# Altium schematic sheet DC-DC-converter_v2.SchDoc: Boost converter
size A4; Author: Alexander Thoresen; CompanyName: VORTEX NTNU; Revision: A; SheetNumber: 1; SheetTotal: 1
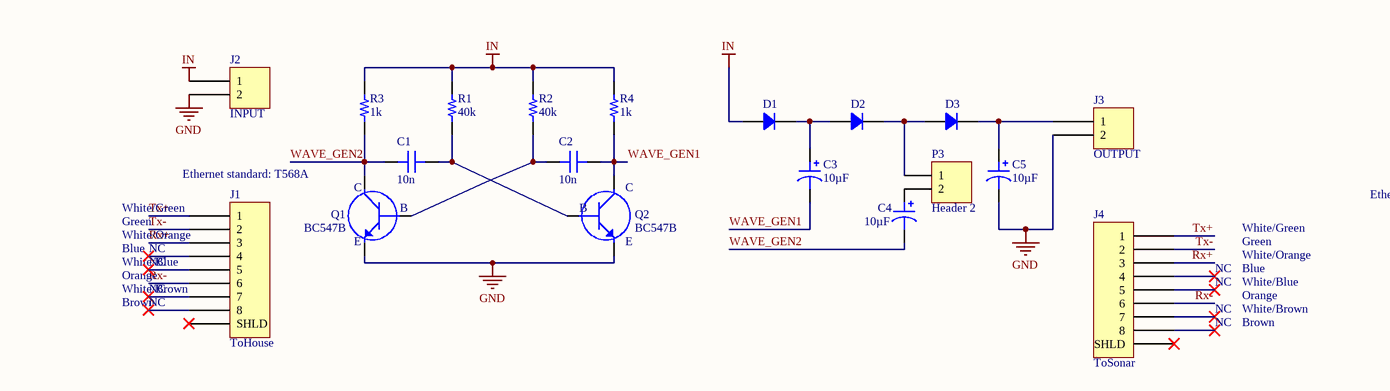
[diagram p0: DC-DC-converter_v2.SchDoc]

## Parts
C1  10n  [CAP 0805_2012]
C2  10n  [CAP 0805_2012]
C3  10µF  [CAP ALSMD 6.6MM H6.1MM]
C4  10µF  [CAP ALSMD 6.6MM H6.1MM]
C5  10µF  [CAP ALSMD 6.6MM H6.1MM]
D1  MBR0580-TP  [SOD-123]  (value not drawn)
D2  MBR0580-TP  [SOD-123]  (value not drawn)
D3  MBR0580-TP  [SOD-123]  (value not drawn)
J1  Custom Description 2: ToHouse  [ASSMANN A-2004-2-4-LPS-N-R]  (hidden comment: A-2004-2-4-LPS-N-R)
J2  Custom Description: INPUT  [MOLEX KK 0022272021]  (hidden comment: 0022272021)
J3  Custom Description: OUTPUT  [MOLEX KK 0022272021]  (hidden comment: 0022272021)
J4  Custom Description 2: ToSonar  [ASSMANN A-2004-2-4-LPS-N-R]  (hidden comment: A-2004-2-4-LPS-N-R)
P3  Header 2  [HDR1X2]
Q1  BC547B  [BC547B]
Q2  BC547B  [BC547B]
R1  40k  [RES 0805_2012]
R2  40k  [RES 0805_2012]
R3  1k  [RES 0805_2012]
R4  1k  [RES 0805_2012]

## Nets
GND: C5.2 J2.2 J3.2 Q1.3 Q2.3
IN: D1.1 J2.1 R1.1 R2.2 R3.1 R4.1
Rx+: J1.3 J4.3
Rx-: J1.6 J4.6
Tx+: J1.1 J4.1
Tx-: J1.2 J4.2
WAVE_GEN1: C2.2 C3.2 Q2.1 R4.2
WAVE_GEN2: C1.1 C4.2 Q1.1 R3.2
NetC1_2: C1.2 Q2.2 R1.2
NetC2_1: C2.1 Q1.2 R2.1
NetC3_1: C3.1 D1.2 D2.1
NetC4_1: C4.1 P3.2
NetC5_1: C5.1 D3.2 J3.1
NetD2_2: D2.2 D3.1 P3.1

Not connected (* = marked no-connect by the designer): J1 4* 5* 7* 8* S(SHLD)*; J4 4* 5* 7* 8* S(SHLD)*

## Notes on the sheet
- Ethernet standard: T568A
- White/Green
- Green
- White/Orange
- Blue
- White/Blue
- NC
- Orange
- White/Brown
- Brown
- Title
- Size
- Author
- Rev
- A4
- Sheet no.
- of
- (in symbol BC547B) C; B; E

## Library data of the parts
C1 C2 = CBR08C330JAGAC: CAP CER 33PF 250V C0G/NP0 0805; Part Number: CBR08C330JAGAC; Value: 10n
C3-C5 = EDK106M063A9GAA: CAP ALUM 10UF 20% 63V SMD; Manufacturer: KEMET; Lifetime @ Temp.: 2000 Hrs @ 85°C; Polarization: Polar; Ripple Current @ High Frequency: 25mA @ 10kHz; Ripple Current @ Low Frequency: 20mA @ 120Hz; Surface Mount Land Size: 0.260" L x 0.260" W (6.60mm x 6.60mm); Part Number: EDK106M063A9GAA; Applications: General Purpose; Capacitance: 10µF; ComponentLink1Description: Datasheet; ComponentLink1URL: https://api.kemet.com/component-edge/download/datasheet/EDK106M063A9GAA.pdf; ComponentLink2Description: DigiKey Link; ComponentLink2URL: http://digikey.com/product-detail/en/kemet/EDK106M063A9GAA/399-6049-1-ND/2712581; Device Package: Radial, Can - SMD; Height - Seated (Max): 0.217" (5.50mm); LastUpdated: 19/01/2020 00:13:02; Lifecycle Status: Active; Minimum Order: 1; Mounting Type: Surface Mount; Operating Temperature: -40°C ~ 85°C; Package / Case: Radial, Can - SMD; Packaging: TapeAndReel; PartId: 8976; Part Status: Active; Price: 0.09; Series: EDK; Size / Dimension: 0.248" Dia (6.30mm); Supplier 1: DigiKey; Supplier Part Number 1: 399-6049-1-ND; Tolerance: ±20%; Value: 10µF; Voltage - Rated: 63V
D1-D3 = MBR0580-TP: DIODE SCHOTTKY 80V 500MA SOD123; Manufacturer: Micro Commercial Co; Capacitance @ Vr, F: 30pF @ 4V, 1MHz; Current - Reverse Leakage @ Vr: 200µA @ 80V; Speed: Fast Recovery =< 500ns, > 200mA (Io); Voltage - Forward (Vf) (Max) @ If: 800mV @ 500mA; Part Number: MBR0580-TP; ComponentLink1Description: Datasheet; ComponentLink1URL: https://www.mccsemi.com/pdf/Products/MBR0520~MBR0580(SOD123).pdf; ComponentLink2Description: DigiKey Link; ComponentLink2URL: http://digikey.com/product-detail/en/micro-commercial-co/MBR0580-TP/MBR0580-TPMSCT-ND/2423306; Current - Average Rectified (Io): 500mA; Device Package: SOD-123; Diode Type: Schottky; LastUpdated: 19/01/2020 00:13:21; Lifecycle Status: Active; Minimum Order: 1; Mounting Type: Surface Mount; Operating Temperature - Junction: -55°C ~ 150°C; Package / Case: SOD-123; Packaging: TapeAndReel; PartId: 2228; Part Status: Active; Price: 0.04; Series: -; Supplier 1: DigiKey; Supplier Part Number 1: MBR0580-TPMSCT-ND; Supplier Device Package: SOD-123; Voltage - DC Reverse (Vr) (Max): 80V
J1 = A-2004-2-4-LPS-N-R: CONN MOD JACK 8P8C R/A SHIELDED; Manufacturer: Assmann WSW Components; LED Color: Does Not Contain LED; Number of Ports: 1; Number of Positions/Contacts: 8p8c (RJ45, Ethernet); Tab Direction: Down; Custom Description1: ToSonar; ComponentLink1Description: Datasheet; ComponentLink1URL: http://www.assmann-wsw.com/fileadmin/datasheets/ASS_7323_CO.pdf; ComponentLink2Description: DigiKey Link; ComponentLink2URL: http://digikey.com/product-detail/en/assmann-wsw-components/A-2004-2-4-LPS-N-R/AE10387-ND/2183638; Connector Type: Jack; Contact Finish: Gold; Contact Material: Phosphor Bronze; Features: Board Lock; LastUpdated: 15/01/2020 03:54:20; Lifecycle Status: Active; Part Number: A-2004-2-4-LPS-N-R; Minimum Order: 1; Mounting Type: Through Hole; Number of Rows: 1; Orientation: 90° Angle (Right); Packaging: Tray; Part Status: Active; Price: 1.05; Series: -; Shielding: Shielded; Supplier 1: DigiKey; Supplier Part Number 1: AE10387-ND; Termination: Solder
J2 J3 = 0022272021: CONN HEADER VERT 2POS 2.54MM; Manufacturer: Molex; Contact Length - Mating: 0.295" (7.49mm); Contact Length - Post: 0.140" (3.56mm); Material Flammability Rating: UL94 V-0; Number of Positions: 2; Number of Positions Loaded: All; Overall Contact Length: 0.560" (14.22mm); Pitch - Mating: 0.100" (2.54mm); Shrouding: Shrouded - 1 Wall; Style: Board to Cable/Wire; ComponentLink1Description: Datasheet; ComponentLink1URL: https://www.molex.com/pdm_docs/sd/022272021_sd.pdf; ComponentLink2Description: DigiKey Link; ComponentLink2URL: http://digikey.com/product-detail/en/molex/0022272021/WM4111-ND/1130577; Connector Type: Header; Contact Finish - Mating: Tin; Contact Finish - Post: Tin; Contact Finish Thickness - Mating: 100.0µin (2.54µm); Contact Material: Brass; Contact Shape: Square; Contact Type: Male Pin; Fastening Type: Friction Lock; Insulation Color: Natural; Insulation Height: 0.461" (11.70mm); Insulation Material: Polyamide (PA), Nylon; LastUpdated: 12/01/2020 23:51:43; Lifecycle Status: Active; Part Number: 0022272021; Minimum Order: 1; Mounting Type: Through Hole; Number of Rows: 1; Packaging: Bulk; PartId: 76; Part Status: Active; Price: 0.27; Series: KK 6410; Supplier 1: DigiKey; Supplier Part Number 1: WM4111-ND; Termination: Solder
J4 = A-2004-2-4-LPS-N-R: CONN MOD JACK 8P8C R/A SHIELDED; Manufacturer: Assmann WSW Components; LED Color: Does Not Contain LED; Number of Ports: 1; Number of Positions/Contacts: 8p8c (RJ45, Ethernet); Tab Direction: Down; ComponentLink1Description: Datasheet; ComponentLink1URL: http://www.assmann-wsw.com/fileadmin/datasheets/ASS_7323_CO.pdf; ComponentLink2Description: DigiKey Link; ComponentLink2URL: http://digikey.com/product-detail/en/assmann-wsw-components/A-2004-2-4-LPS-N-R/AE10387-ND/2183638; Connector Type: Jack; Contact Finish: Gold; Contact Material: Phosphor Bronze; Features: Board Lock; LastUpdated: 15/01/2020 03:54:20; Lifecycle Status: Active; Part Number: A-2004-2-4-LPS-N-R; Minimum Order: 1; Mounting Type: Through Hole; Number of Rows: 1; Orientation: 90° Angle (Right); Packaging: Tray; Part Status: Active; Price: 1.05; Series: -; Shielding: Shielded; Supplier 1: DigiKey; Supplier Part Number 1: AE10387-ND; Termination: Solder; Custom Description1: ToSonar
P3 = Header 2: Header, 2-Pin; LatestRevisionDate: 17-Jul-2002; LatestRevisionNote: Re-released for DXP Platform.; Publisher: Altium Limited
R1-R4 = TLRZ2ATTD: RES 0 OHM JUMPER 0805; Part Number: TLRZ2ATTD
  R1 R2: Value: 40k
  R3 R4: Value: 1k